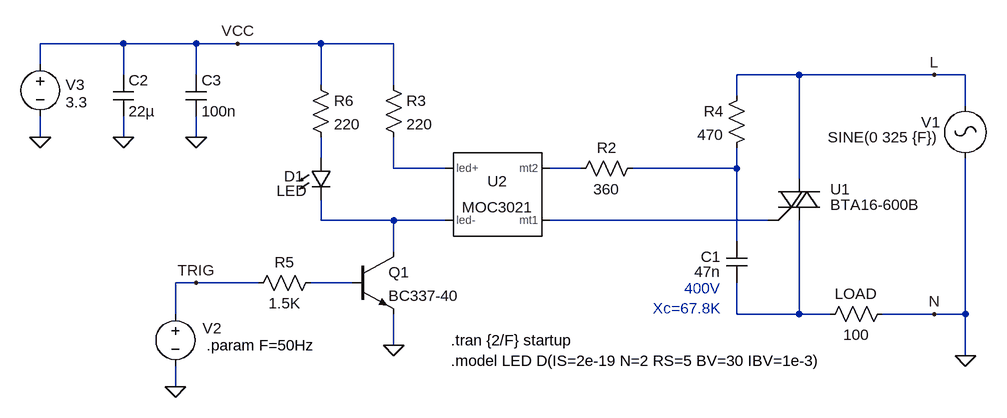
[diagram p0: schematic v2.0.asc]
v2.0.asc, the LTspice schematic file:
Version 4.1
SHEET 1 1132 824
WIRE -1456 -144 -1584 -144
WIRE -1344 -144 -1456 -144
WIRE -1280 -144 -1344 -144
WIRE -1152 -144 -1280 -144
WIRE -1040 -144 -1152 -144
WIRE -1584 -112 -1584 -144
WIRE -1456 -96 -1456 -144
WIRE -1344 -96 -1344 -144
WIRE -416 -96 -512 -96
WIRE -208 -96 -416 -96
WIRE -160 -96 -208 -96
WIRE -1152 -80 -1152 -144
WIRE -1040 -80 -1040 -144
WIRE -512 -64 -512 -96
WIRE -160 -48 -160 -96
WIRE -1584 0 -1584 -32
WIRE -1456 0 -1456 -32
WIRE -1344 0 -1344 -32
WIRE -1152 32 -1152 0
WIRE -1040 48 -1040 0
WIRE -960 48 -1040 48
WIRE -752 48 -800 48
WIRE -512 48 -512 16
WIRE -512 48 -672 48
WIRE -416 64 -416 -96
WIRE -1152 128 -1152 96
WIRE -1040 128 -1152 128
WIRE -960 128 -1040 128
WIRE -464 128 -800 128
WIRE -512 160 -512 48
WIRE -1040 176 -1040 128
WIRE -1344 224 -1376 224
WIRE -1248 224 -1344 224
WIRE -1104 224 -1168 224
WIRE -1376 272 -1376 224
WIRE -512 272 -512 224
WIRE -416 272 -416 128
WIRE -416 272 -512 272
WIRE -368 272 -416 272
WIRE -208 272 -288 272
WIRE -160 272 -160 32
WIRE -160 272 -208 272
WIRE -1040 320 -1040 272
WIRE -160 336 -160 272
WIRE -1376 384 -1376 352
FLAG -160 336 0
FLAG -1376 384 0
FLAG -1040 320 0
FLAG -208 -96 L
FLAG -1344 224 TRIG
FLAG -1584 0 0
FLAG -1280 -144 VCC
FLAG -1344 0 0
FLAG -1456 0 0
FLAG -208 272 N
SYMBOL res -384 288 R270
WINDOW 0 32 56 VTop 2
WINDOW 3 0 56 VBottom 2
SYMATTR InstName LOAD
SYMATTR Value 100
SYMBOL res -656 32 R90
WINDOW 0 0 56 VBottom 2
WINDOW 3 32 56 VTop 2
SYMATTR InstName R2
SYMATTR Value 360
SYMBOL res -1056 -96 R0
SYMATTR InstName R3
SYMATTR Value 220
SYMBOL voltage -1376 256 R0
WINDOW 3 -49 -29 Invisible 2
WINDOW 123 0 0 Left 0
WINDOW 39 0 0 Left 0
WINDOW 0 42 38 Left 2
SYMATTR Value PULSE(0 3.3 0.004 1n 1n 200u {1/(2*F)})
SYMATTR InstName V2
SYMBOL res -496 -80 M0
SYMATTR InstName R4
SYMATTR Value 470
SYMATTR SpiceLine pwr=2
SYMBOL cap -528 160 R0
WINDOW 0 -39 24 Left 2
WINDOW 3 -49 47 Left 2
SYMATTR InstName C1
SYMATTR Value 47n
SYMATTR SpiceLine V=400
SYMBOL npn -1104 176 R0
SYMATTR InstName Q1
SYMATTR Value BC337-40
SYMBOL voltage -1584 -128 R0
WINDOW 0 39 47 Left 2
WINDOW 3 39 74 Left 2
WINDOW 123 0 0 Left 0
WINDOW 39 0 0 Left 0
SYMATTR InstName V3
SYMATTR Value 3.3
SYMBOL res -1152 208 R90
WINDOW 0 0 56 VBottom 2
WINDOW 3 32 56 VTop 2
SYMATTR InstName R5
SYMATTR Value 1.5K
SYMBOL LED -1168 32 R0
WINDOW 0 -41 28 Left 2
WINDOW 3 -52 50 Left 2
SYMATTR InstName D1
SYMATTR Value LED
SYMBOL res -1168 -96 R0
SYMATTR InstName R6
SYMATTR Value 220
SYMBOL MyLib\\Opto\\MOC3021 -912 64 R0
SYMATTR InstName U2
SYMBOL cap -1472 -96 R0
SYMATTR InstName C2
SYMATTR Value 22µ
SYMBOL cap -1360 -96 R0
SYMATTR InstName C3
SYMATTR Value 100n
SYMBOL MyLib\\Voltage_AC -160 -64 M0
WINDOW 123 0 0 Left 0
WINDOW 39 0 0 Left 0
SYMATTR InstName V1
SYMATTR Value SINE(0 325 {F})
SYMBOL MyLib\\TRIAC\\BTA16-600B -448 64 R0
SYMATTR InstName U1
TEXT -952 312 Left 2 !.tran {2/F} startup
TEXT -536 232 Right 2 ;400V\nXc=67.8K
TEXT -952 344 Left 2 !.model LED D(IS=2e-19 N=2 RS=5 BV=30 IBV=1e-3)
TEXT -1328 320 Left 2 !.param F=50Hz

The netlist it stands for:
* v2.0.asc
R§LOAD N008 0 100
R2 N004 N003 360
R3 VCC N002 220
V2 TRIG 0 PULSE(0 3.3 0.004 1n 1n 200u {1/(2*F)})
R4 L N004 470 pwr=2
C1 N004 N008 47n V=400
Q1 N005 N007 0 0 BC337-40
V3 VCC 0 3.3
R5 N007 TRIG 1.5K
D1 N001 N005 LED
R6 VCC N001 220
X§U2 N002 N005 N003 N006 MOC3021  ; pins led+ led- mt2 mt1
C2 VCC 0 22µ
C3 VCC 0 100n
V1 L 0 SINE(0 325 {F})
X§U1 L N006 N008 BTA16-600B  ; pins MT2 G MT1
.model D D
.lib standard.dio
.model NPN NPN
.model PNP PNP
.lib standard.bjt
.tran {2/F} startup
* 400V
* Xc=67.8K
.model LED D(IS=2e-19 N=2 RS=5 BV=30 IBV=1e-3)
.param F=50Hz
.lib MOC3021.lib
.lib MyLib/TRIAC/_TRIAC_ST.lib
.backanno
.end